# EAGLE design Display18_Cape (EAGLE 7.7.0)
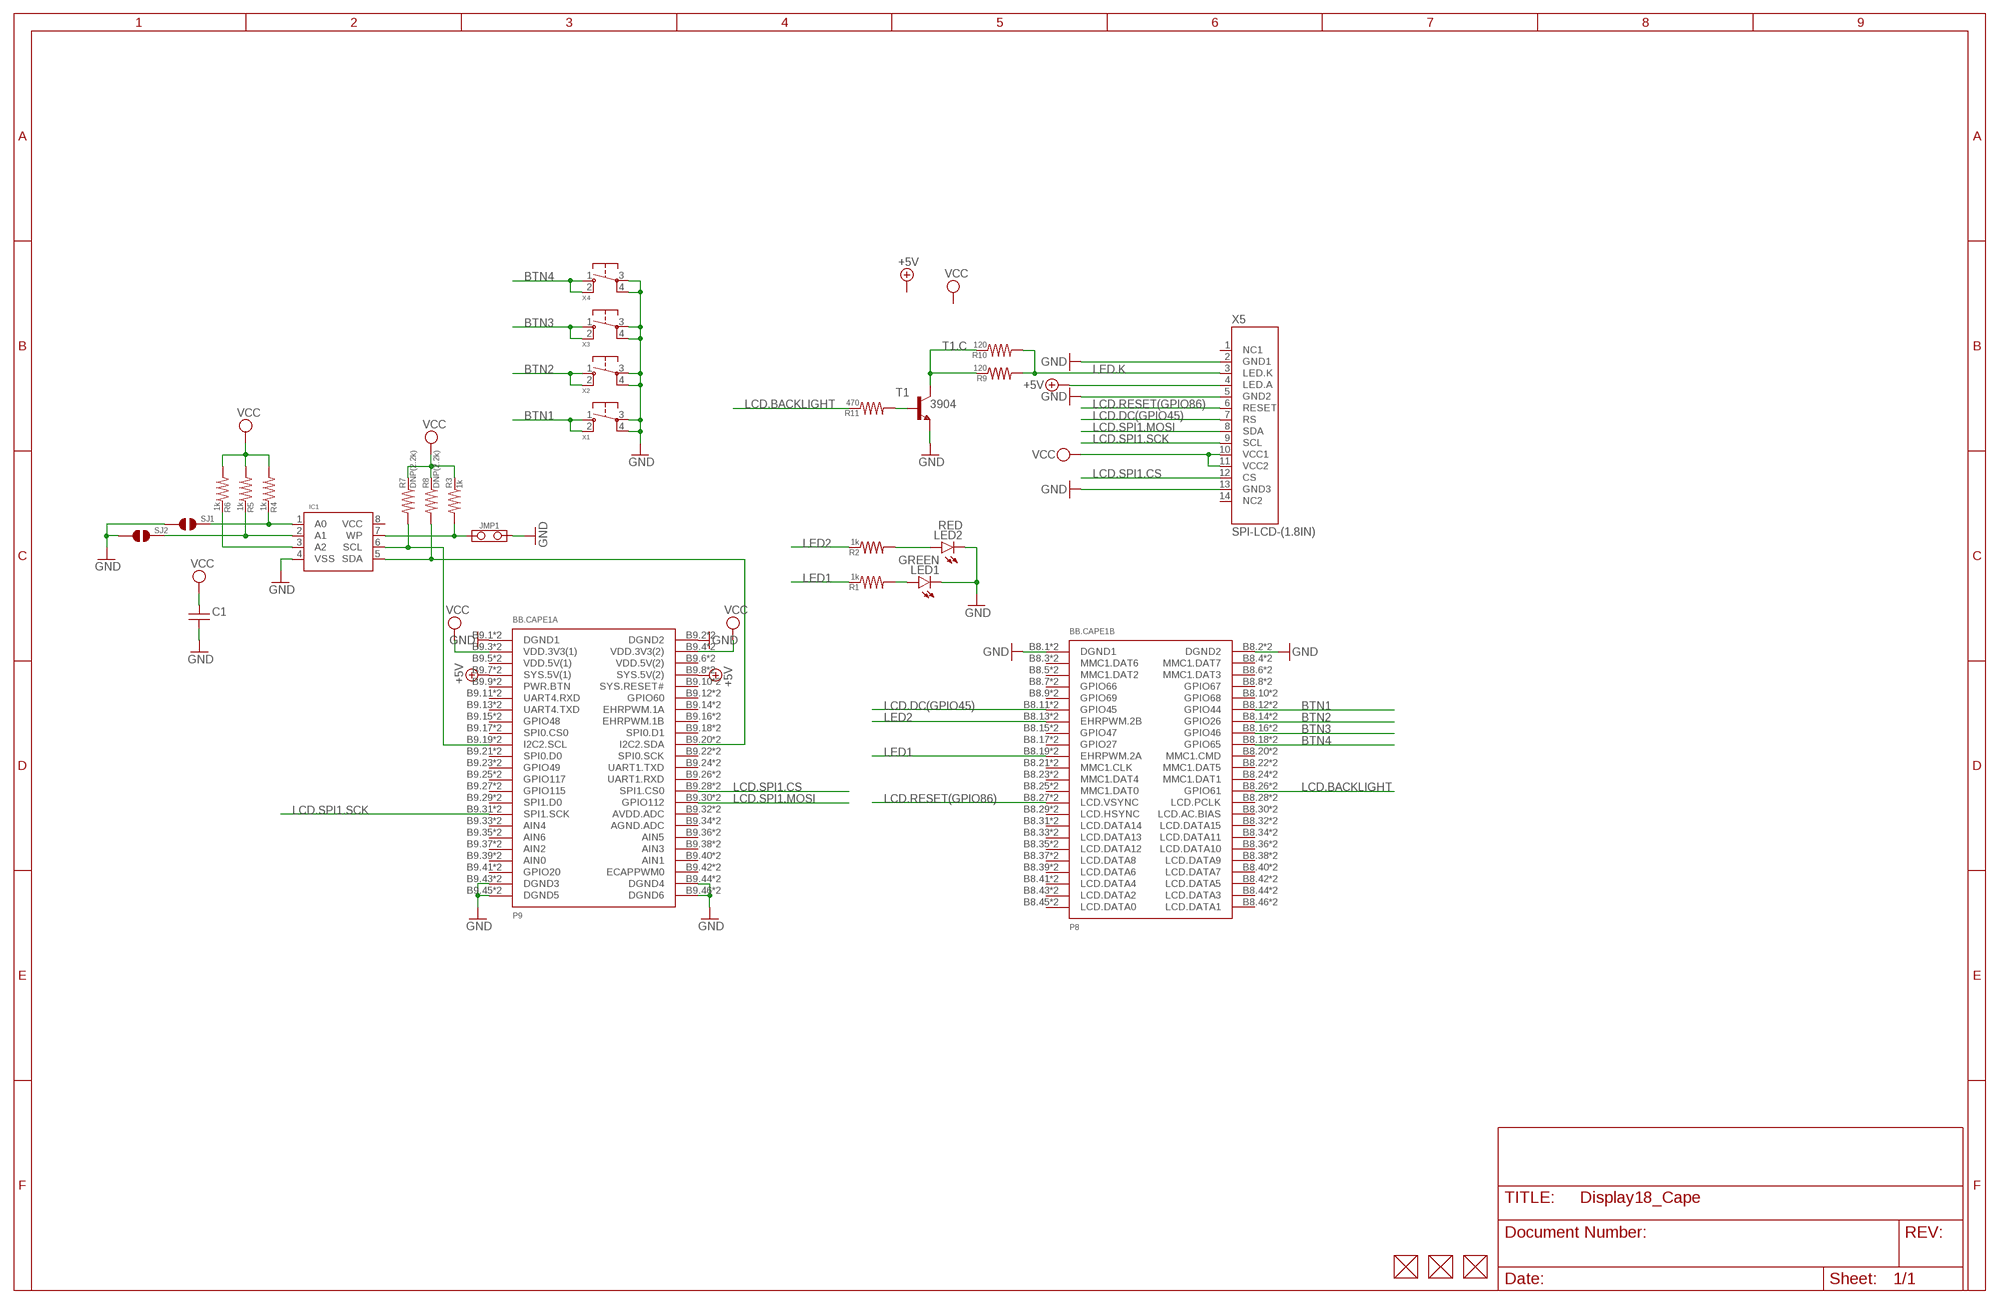
[diagram p0: schematic, sheet 1]

## Parts
BB.CAPE1  BEAGLEBONE.CAPE.BOTTOM-ONLY-PADS.W/TH  [BEAGLEBONE.CAPE.BOTTOM-ONLY-PADS.W/TH]
C1  CAPACITOR-(INCH)-0402  [0402]
FUD1  FIDUCIAL  [FIDUCIAL_40MIL]
FUD2  FIDUCIAL  [FIDUCIAL_40MIL]
FUD3  FIDUCIAL  [FIDUCIAL_40MIL]
IC1  CAT24C32  [UDFN8,2X3(ON-SEMI)]
JMP1  JUMPER-(X2)  [JUMPER-(X2)]
LED1  GREEN  LED-(INCH)-0805  [0805-LED]
LED2  RED  LED-(INCH)-0805  [0805-LED]
R1  1k  RESISTOR-(INCH)-0603  [0603]
R2  1k  RESISTOR-(INCH)-0603  [0603]
R3  1k  RESISTOR-(INCH)-0402  [0402]
R4  1k  RESISTOR-(INCH)-0402  [0402]
R5  1k  RESISTOR-(INCH)-0402  [0402]
R6  1k  RESISTOR-(INCH)-0402  [0402]
R7  DNP(2.2k)  RESISTOR-(INCH)-0402  [0402]
R8  DNP(2.2k)  RESISTOR-(INCH)-0402  [0402]
R9  120  RESISTOR-(INCH)-0603  [0603]
R10  120  RESISTOR-(INCH)-0603  [0603]
R11  470  RESISTOR-(INCH)-0603  [0603]
SJ1  SOLDER.JOINT-(INCH)-0603  [SOLDER.JOINT(0603)]
SJ2  SOLDER.JOINT-(INCH)-0603  [SOLDER.JOINT(0603)]
T1  3904  BC847-NPN-SOT23-BEC  [SOT23-BEC]
X1  6MM_TACTILE_SWITCH  [6MM_TACTILE-SWITCH]
X2  6MM_TACTILE_SWITCH  [6MM_TACTILE-SWITCH]
X3  6MM_TACTILE_SWITCH  [6MM_TACTILE-SWITCH]
X4  6MM_TACTILE_SWITCH  [6MM_TACTILE-SWITCH]
X5  SPI-LCD-(1.8IN)  [LCD-(1.8IN)]

## Nets
+5V: BB.CAPE1.B9.7(A:SYS.5V(1)) BB.CAPE1.B9.8(A:SYS.5V(2)) BB.CAPE1.P9.7(A:SYS.5V(1)) BB.CAPE1.P9.8(A:SYS.5V(2)) X5.4(LED.A)
A0: IC1.1(A0) R4.2 SJ1.2
A1: IC1.2(A1) R5.2 SJ2.2
A2: IC1.3(A2) R6.2
BTN1: BB.CAPE1.B8.12(B:GPIO44) BB.CAPE1.P8.12(B:GPIO44) X1.1 X1.2
BTN2: BB.CAPE1.B8.14(B:GPIO26) BB.CAPE1.P8.14(B:GPIO26) X2.1 X2.2
BTN3: BB.CAPE1.B8.16(B:GPIO46) BB.CAPE1.P8.16(B:GPIO46) X3.1 X3.2
BTN4: BB.CAPE1.B8.18(B:GPIO65) BB.CAPE1.P8.18(B:GPIO65) X4.1 X4.2
GND: BB.CAPE1.B8.1(B:DGND1) BB.CAPE1.B8.2(B:DGND2) BB.CAPE1.B9.1(A:DGND1) BB.CAPE1.B9.2(A:DGND2) BB.CAPE1.B9.43(A:DGND3) BB.CAPE1.B9.44(A:DGND4) BB.CAPE1.B9.45(A:DGND5) BB.CAPE1.B9.46(A:DGND6) BB.CAPE1.P8.1(B:DGND1) BB.CAPE1.P8.2(B:DGND2) BB.CAPE1.P9.1(A:DGND1) BB.CAPE1.P9.2(A:DGND2) BB.CAPE1.P9.43(A:DGND3) BB.CAPE1.P9.44(A:DGND4) BB.CAPE1.P9.45(A:DGND5) BB.CAPE1.P9.46(A:DGND6) C1.2 IC1.4(VSS) JMP1.2 LED1.K LED2.K SJ1.1 SJ2.1 T1.E X1.3 X1.4 X2.3 X2.4 X3.3 X3.4 X4.3 X4.4 X5.2(GND1) X5.5(GND2) X5.13(GND3)
LCD.BACKLIGHT: BB.CAPE1.B8.26(B:GPIO61) BB.CAPE1.P8.26(B:GPIO61) R11.2
LCD.DC(GPIO45): BB.CAPE1.B8.11(B:GPIO45) BB.CAPE1.P8.11(B:GPIO45) X5.7(RS)
LCD.RESET(GPIO86): BB.CAPE1.B8.27(B:LCD.VSYNC) BB.CAPE1.P8.27(B:LCD.VSYNC) X5.6(RESET)
LCD.SPI1.CS: BB.CAPE1.B9.28(A:SPI1.CS0) BB.CAPE1.P9.28(A:SPI1.CS0) X5.12(CS)
LCD.SPI1.MOSI: BB.CAPE1.B9.30(A:GPIO112) BB.CAPE1.P9.30(A:GPIO112) X5.8(SDA)
LCD.SPI1.SCK: BB.CAPE1.B9.31(A:SPI1.SCK) BB.CAPE1.P9.31(A:SPI1.SCK) X5.9(SCL)
LED1: BB.CAPE1.B8.19(B:EHRPWM.2A) BB.CAPE1.P8.19(B:EHRPWM.2A) R1.2
LED2: BB.CAPE1.B8.13(B:EHRPWM.2B) BB.CAPE1.P8.13(B:EHRPWM.2B) R2.2
LED.K: R9.1 R10.1 X5.3(LED.K)
N$5: R11.1 T1.B
N$282: LED1.A R1.1
N$284: LED2.A R2.1
SCL: BB.CAPE1.B9.19(A:I2C2.SCL) BB.CAPE1.P9.19(A:I2C2.SCL) IC1.6(SCL) R7.1
SDA: BB.CAPE1.B9.20(A:I2C2.SDA) BB.CAPE1.P9.20(A:I2C2.SDA) IC1.5(SDA) R8.1
T1.C: R9.2 R10.2 T1.C
VCC: BB.CAPE1.B9.3(A:VDD.3V3(1)) BB.CAPE1.B9.4(A:VDD.3V3(2)) BB.CAPE1.P9.3(A:VDD.3V3(1)) BB.CAPE1.P9.4(A:VDD.3V3(2)) C1.1 R3.2 R4.1 R5.1 R6.1 R7.2 R8.2 X5.10(VCC1) X5.11(VCC2)
WP: IC1.7(WP) JMP1.1 R3.1
Unconnected: BB.CAPE1.B8.3(B:MMC1.DAT6) BB.CAPE1.B8.4(B:MMC1.DAT7) BB.CAPE1.B8.5(B:MMC1.DAT2) BB.CAPE1.B8.6(B:MMC1.DAT3) BB.CAPE1.B8.7(B:GPIO66) BB.CAPE1.B8.8(B:GPIO67) BB.CAPE1.B8.9(B:GPIO69) BB.CAPE1.B8.10(B:GPIO68) BB.CAPE1.B8.15(B:GPIO47) BB.CAPE1.B8.17(B:GPIO27) BB.CAPE1.B8.20(B:MMC1.CMD) BB.CAPE1.B8.21(B:MMC1.CLK) BB.CAPE1.B8.22(B:MMC1.DAT5) BB.CAPE1.B8.23(B:MMC1.DAT4) BB.CAPE1.B8.24(B:MMC1.DAT1) BB.CAPE1.B8.25(B:MMC1.DAT0) BB.CAPE1.B8.28(B:LCD.PCLK) BB.CAPE1.B8.29(B:LCD.HSYNC) BB.CAPE1.B8.30(B:LCD.AC.BIAS) BB.CAPE1.B8.31(B:LCD.DATA14) BB.CAPE1.B8.32(B:LCD.DATA15) BB.CAPE1.B8.33(B:LCD.DATA13) BB.CAPE1.B8.34(B:LCD.DATA11) BB.CAPE1.B8.35(B:LCD.DATA12) BB.CAPE1.B8.36(B:LCD.DATA10) BB.CAPE1.B8.37(B:LCD.DATA8) BB.CAPE1.B8.38(B:LCD.DATA9) BB.CAPE1.B8.39(B:LCD.DATA6) BB.CAPE1.B8.40(B:LCD.DATA7) BB.CAPE1.B8.41(B:LCD.DATA4) BB.CAPE1.B8.42(B:LCD.DATA5) BB.CAPE1.B8.43(B:LCD.DATA2) BB.CAPE1.B8.44(B:LCD.DATA3) BB.CAPE1.B8.45(B:LCD.DATA0) BB.CAPE1.B8.46(B:LCD.DATA1) BB.CAPE1.B9.5(A:VDD.5V(1)) BB.CAPE1.B9.6(A:VDD.5V(2)) BB.CAPE1.B9.9(A:PWR.BTN) BB.CAPE1.B9.10(A:SYS.RESET#) BB.CAPE1.B9.11(A:UART4.RXD) BB.CAPE1.B9.12(A:GPIO60) BB.CAPE1.B9.13(A:UART4.TXD) BB.CAPE1.B9.14(A:EHRPWM.1A) BB.CAPE1.B9.15(A:GPIO48) BB.CAPE1.B9.16(A:EHRPWM.1B) BB.CAPE1.B9.17(A:SPI0.CS0) BB.CAPE1.B9.18(A:SPI0.D1) BB.CAPE1.B9.21(A:SPI0.D0) BB.CAPE1.B9.22(A:SPI0.SCK) BB.CAPE1.B9.23(A:GPIO49) BB.CAPE1.B9.24(A:UART1.TXD) BB.CAPE1.B9.25(A:GPIO117) BB.CAPE1.B9.26(A:UART1.RXD) BB.CAPE1.B9.27(A:GPIO115) BB.CAPE1.B9.29(A:SPI1.D0) BB.CAPE1.B9.32(A:AVDD.ADC) BB.CAPE1.B9.33(A:AIN4) BB.CAPE1.B9.34(A:AGND.ADC) BB.CAPE1.B9.35(A:AIN6) BB.CAPE1.B9.36(A:AIN5) BB.CAPE1.B9.37(A:AIN2) BB.CAPE1.B9.38(A:AIN3) BB.CAPE1.B9.39(A:AIN0) BB.CAPE1.B9.40(A:AIN1) BB.CAPE1.B9.41(A:GPIO20) BB.CAPE1.B9.42(A:ECAPPWM0) BB.CAPE1.P8.3(B:MMC1.DAT6) BB.CAPE1.P8.4(B:MMC1.DAT7) BB.CAPE1.P8.5(B:MMC1.DAT2) BB.CAPE1.P8.6(B:MMC1.DAT3) BB.CAPE1.P8.7(B:GPIO66) BB.CAPE1.P8.8(B:GPIO67) BB.CAPE1.P8.9(B:GPIO69) BB.CAPE1.P8.10(B:GPIO68) BB.CAPE1.P8.15(B:GPIO47) BB.CAPE1.P8.17(B:GPIO27) BB.CAPE1.P8.20(B:MMC1.CMD) BB.CAPE1.P8.21(B:MMC1.CLK) BB.CAPE1.P8.22(B:MMC1.DAT5) BB.CAPE1.P8.23(B:MMC1.DAT4) BB.CAPE1.P8.24(B:MMC1.DAT1) BB.CAPE1.P8.25(B:MMC1.DAT0) BB.CAPE1.P8.28(B:LCD.PCLK) BB.CAPE1.P8.29(B:LCD.HSYNC) BB.CAPE1.P8.30(B:LCD.AC.BIAS) BB.CAPE1.P8.31(B:LCD.DATA14) BB.CAPE1.P8.32(B:LCD.DATA15) BB.CAPE1.P8.33(B:LCD.DATA13) BB.CAPE1.P8.34(B:LCD.DATA11) BB.CAPE1.P8.35(B:LCD.DATA12) BB.CAPE1.P8.36(B:LCD.DATA10) BB.CAPE1.P8.37(B:LCD.DATA8) BB.CAPE1.P8.38(B:LCD.DATA9) BB.CAPE1.P8.39(B:LCD.DATA6) BB.CAPE1.P8.40(B:LCD.DATA7) BB.CAPE1.P8.41(B:LCD.DATA4) BB.CAPE1.P8.42(B:LCD.DATA5) BB.CAPE1.P8.43(B:LCD.DATA2) BB.CAPE1.P8.44(B:LCD.DATA3) BB.CAPE1.P8.45(B:LCD.DATA0) BB.CAPE1.P8.46(B:LCD.DATA1) BB.CAPE1.P9.5(A:VDD.5V(1)) BB.CAPE1.P9.6(A:VDD.5V(2)) BB.CAPE1.P9.9(A:PWR.BTN) BB.CAPE1.P9.10(A:SYS.RESET#) BB.CAPE1.P9.11(A:UART4.RXD) BB.CAPE1.P9.12(A:GPIO60) BB.CAPE1.P9.13(A:UART4.TXD) BB.CAPE1.P9.14(A:EHRPWM.1A) BB.CAPE1.P9.15(A:GPIO48) BB.CAPE1.P9.16(A:EHRPWM.1B) BB.CAPE1.P9.17(A:SPI0.CS0) BB.CAPE1.P9.18(A:SPI0.D1) BB.CAPE1.P9.21(A:SPI0.D0) BB.CAPE1.P9.22(A:SPI0.SCK) BB.CAPE1.P9.23(A:GPIO49) BB.CAPE1.P9.24(A:UART1.TXD) BB.CAPE1.P9.25(A:GPIO117) BB.CAPE1.P9.26(A:UART1.RXD) BB.CAPE1.P9.27(A:GPIO115) BB.CAPE1.P9.29(A:SPI1.D0) BB.CAPE1.P9.32(A:AVDD.ADC) BB.CAPE1.P9.33(A:AIN4) BB.CAPE1.P9.34(A:AGND.ADC) BB.CAPE1.P9.35(A:AIN6) BB.CAPE1.P9.36(A:AIN5) BB.CAPE1.P9.37(A:AIN2) BB.CAPE1.P9.38(A:AIN3) BB.CAPE1.P9.39(A:AIN0) BB.CAPE1.P9.40(A:AIN1) BB.CAPE1.P9.41(A:GPIO20) BB.CAPE1.P9.42(A:ECAPPWM0) FUD1.P$1 FUD2.P$1 FUD3.P$1 IC1.8(VCC) X5.1(NC1) X5.14(NC2)

## Library data of the parts
BB.CAPE1 = GHI-Solutions:BEAGLEBONE.CAPE.
C1 = GHI-BasicComponents:CAPACITOR-(INCH)-: Basic SMD ceramic capacitors
FUD1-FUD3 = GHI:FIDUCIAL
IC1 = GHI-IC:CAT24C32: 32-Kb I2C CMOS Serial EEPROM
JMP1 = GHI-Headers:JUMPER-(X2)
LED1 LED2 = GHI-BasicComponents:LED-(INCH)-: Basic SMD LEDs
R1-R11 = GHI-BasicComponents:RESISTOR-(INCH)-: Basic SMD Resistors
SJ1 SJ2 = GHI-Miscellaneous:SOLDER.JOINT-(INCH)-: Solder Joint (Bridge) Pads - For easy solder joining.
T1 = transistor:*-NPN-: NPN Transistror BF959 corrected 2008.03.06
X1-X4 = GHI2:6MM_TACTILE_SWITCH
X5 = GHI-Connectors:SPI-LCD-(1.8IN)

## Board
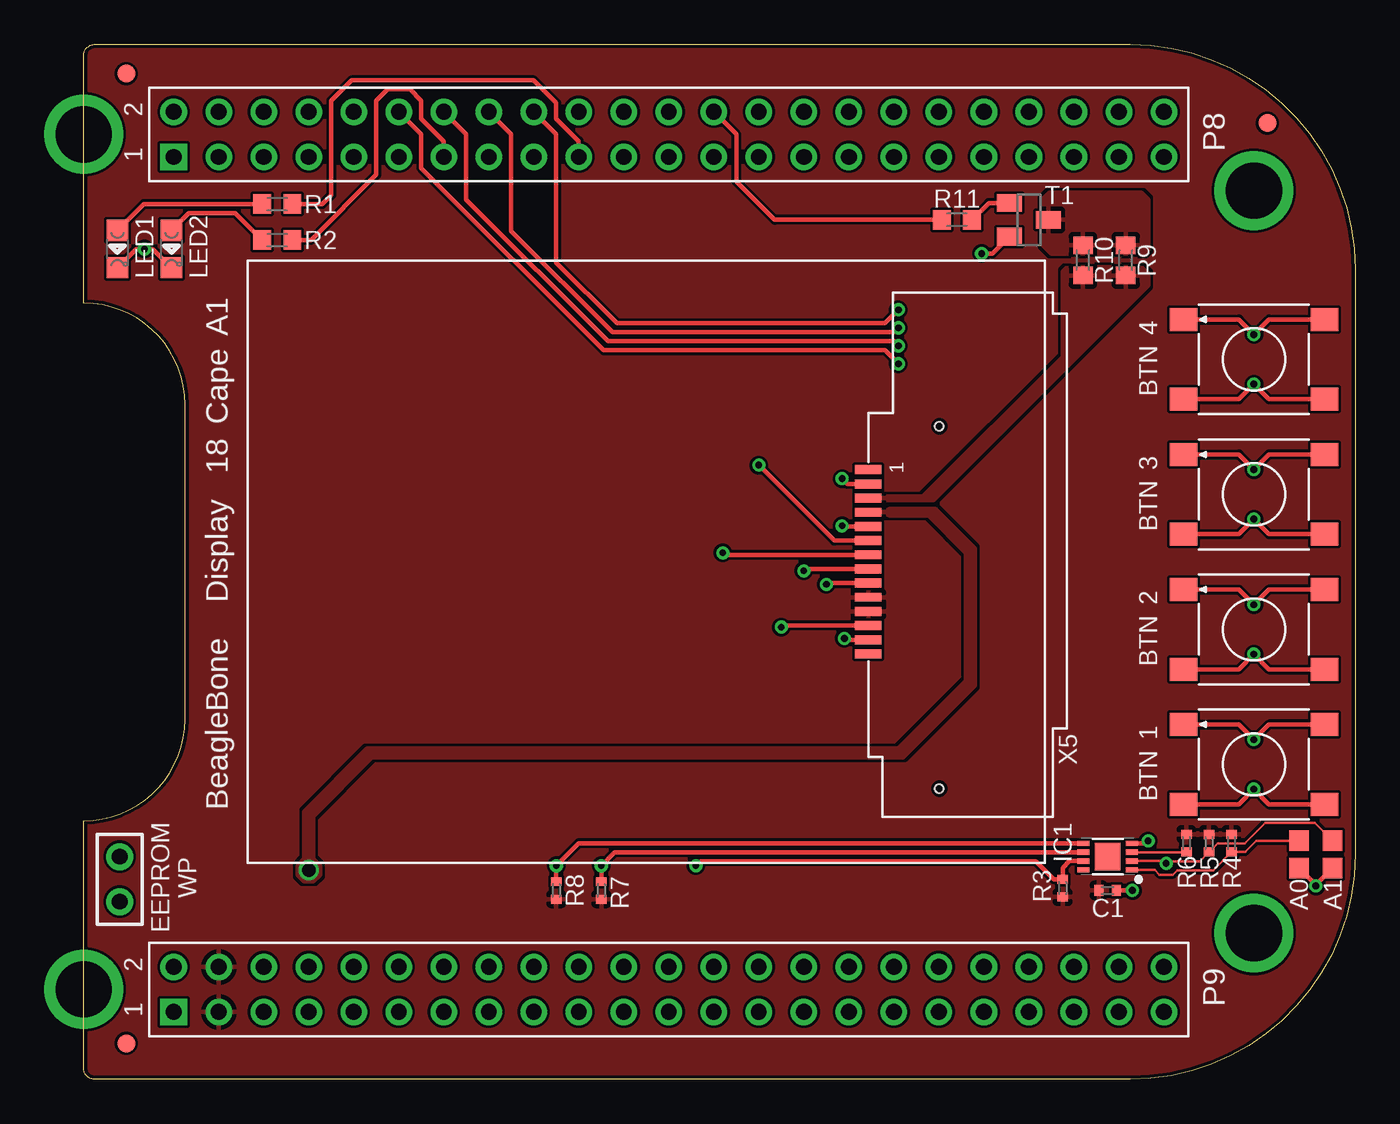
[diagram p1: board, top side]
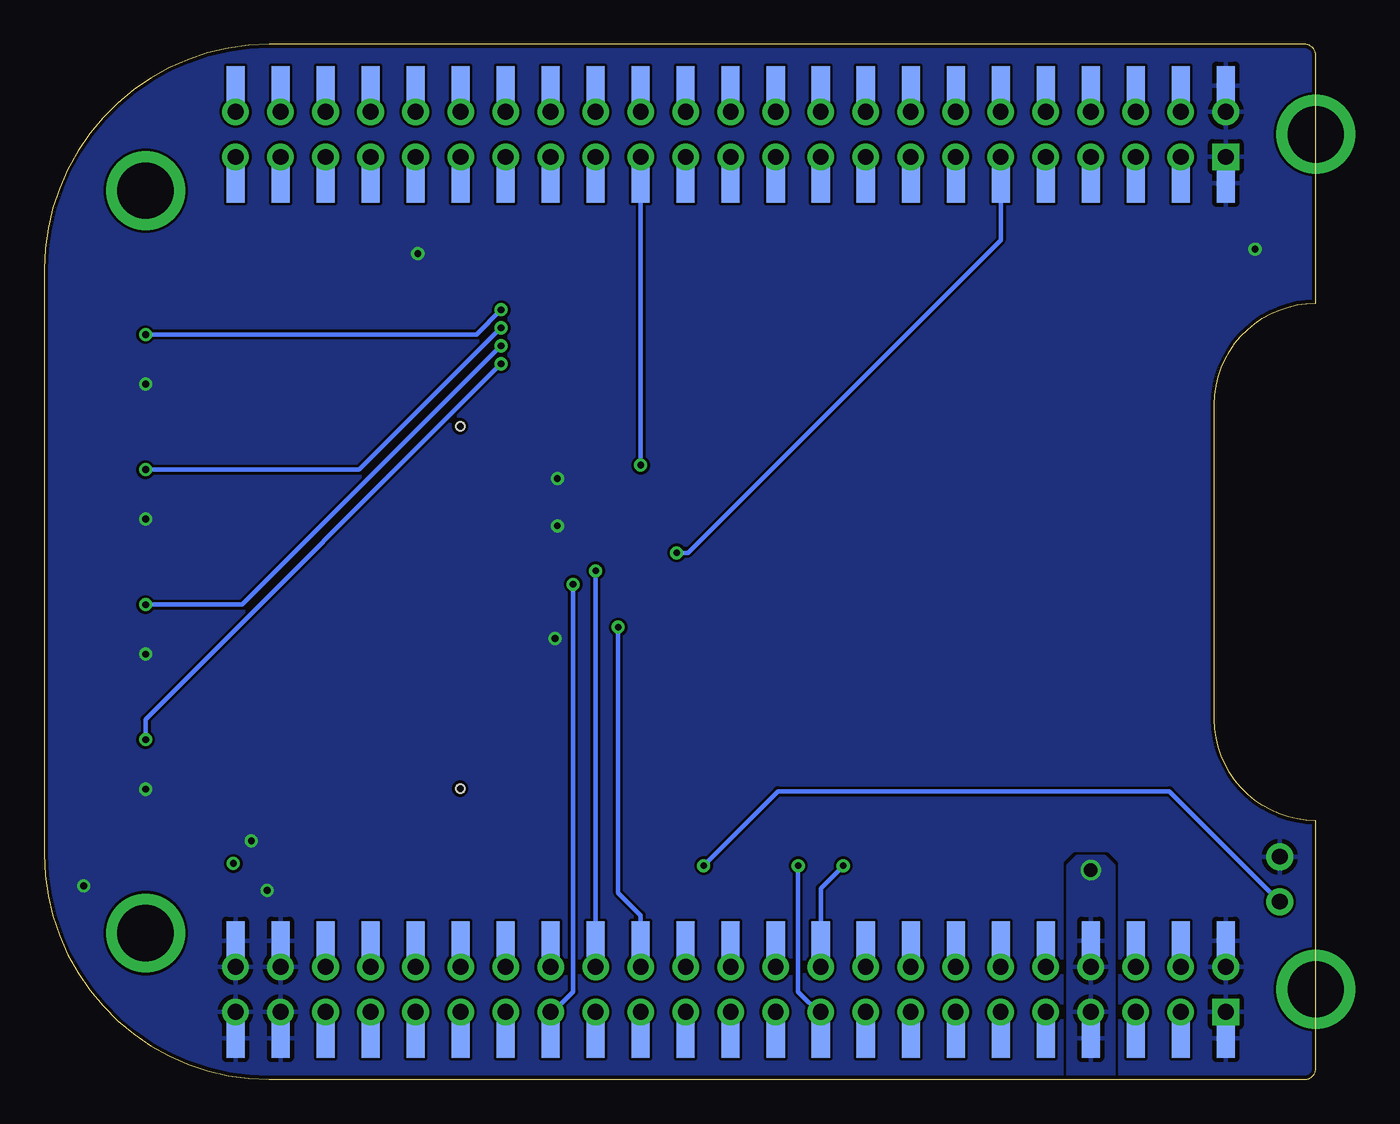
[diagram p2: board, bottom side, seen from below]

Size 71.75 x 58.42 mm. Coordinates in mm from the lower left corner, seen from the top.
Copper layers (1+16): Top 0.035mm / dielectric 1.5mm / Bottom 0.035mm
Design rules "SparkFun-2-layer *": minimum track width 6mil, minimum drill 15mil, track to track 6mil, track to pad 6mil, pad to pad 6mil, via to via 6mil, smd to smd 6mil, copper to edge 8mil, drill to drill 8mil, minimum pad ring 12mil, minimum via ring 7mil, stop-mask expansion 4mil, vias tented up to drill 32mil, thermal gap 10mil
tRestrict: 4 lines

### Footprints (pad centres in the part's own frame; a part is rotated, then mirrored left to right if it is on the bottom)
BEAGLEBONE.CAPE.BOTTOM-ONLY-PADS.W/TH = smd 1.02 x 2.2 bottom: B8.1 5.08,50.59; B8.2 5.08,56.09; B8.3 7.62,50.59; B8.4 7.62,56.09; B8.5 10.16,50.59; B8.6 10.16,56.09; B8.7 12.7,50.59; B8.8 12.7,56.09; B8.9 15.24,50.59; B8.10 15.24,56.09; B8.11 17.78,50.59; B8.12 17.78,56.09; B8.13 20.32,50.59; B8.14 20.32,56.09; B8.15 22.86,50.59; B8.16 22.86,56.09; B8.17 25.4,50.59; B8.18 25.4,56.09; B8.19 27.94,50.59; B8.20 27.94,56.09; B8.21 30.48,50.59; B8.22 30.48,56.09; B8.23 33.02,50.59; B8.24 33.02,56.09; B8.25 35.56,50.59; B8.26 35.56,56.09; B8.27 38.1,50.59; B8.28 38.1,56.09; B8.29 40.64,50.59; B8.30 40.64,56.09; B8.31 43.18,50.59; B8.32 43.18,56.09; B8.33 45.72,50.59; B8.34 45.72,56.09; B8.35 48.26,50.59; B8.36 48.26,56.09; B8.37 50.8,50.59; B8.38 50.8,56.09; B8.39 53.34,50.59; B8.40 53.34,56.09; B8.41 55.88,50.59; B8.42 55.88,56.09; B8.43 58.42,50.59; B8.44 58.42,56.09; B8.45 60.96,50.59; B8.46 60.96,56.09; B9.1 5.08,2.33; B9.2 5.08,7.83; B9.3 7.62,2.33; B9.4 7.62,7.83; B9.5 10.16,2.33; B9.6 10.16,7.83; B9.7 12.7,2.33; B9.8 12.7,7.83; B9.9 15.24,2.33; B9.10 15.24,7.83; B9.11 17.78,2.33; B9.12 17.78,7.83; B9.13 20.32,2.33; B9.14 20.32,7.83; B9.15 22.86,2.33; B9.16 22.86,7.83; B9.17 25.4,2.33; B9.18 25.4,7.83; B9.19 27.94,2.33; B9.20 27.94,7.83; B9.21 30.48,2.33; B9.22 30.48,7.83; B9.23 33.02,2.33; B9.24 33.02,7.83; B9.25 35.56,2.33; B9.26 35.56,7.83; B9.27 38.1,2.33; B9.28 38.1,7.83; B9.29 40.64,2.33; B9.30 40.64,7.83; B9.31 43.18,2.33; B9.32 43.18,7.83; B9.33 45.72,2.33; B9.34 45.72,7.83; B9.35 48.26,2.33; B9.36 48.26,7.83; B9.37 50.8,2.33; B9.38 50.8,7.83; B9.39 53.34,2.33; B9.40 53.34,7.83; B9.41 55.88,2.33; B9.42 55.88,7.83; B9.43 58.42,2.33; B9.44 58.42,7.83; B9.45 60.96,2.33; B9.46 60.96,7.83 | drill 3.175 pad 4.445: MH.1 0,5.08; MH.2 66.04,8.255; MH.3 66.04,50.165; MH.4 0,53.34 | drill 0.889 square: P8.1 5.08,52.07; P9.1 5.08,3.81 | drill 0.889: P8.2 5.08,54.61; P8.3 7.62,52.07; P8.4 7.62,54.61; P8.5 10.16,52.07; P8.6 10.16,54.61; P8.7 12.7,52.07; P8.8 12.7,54.61; P8.9 15.24,52.07; P8.10 15.24,54.61; P8.11 17.78,52.07; P8.12 17.78,54.61; P8.13 20.32,52.07; P8.14 20.32,54.61; P8.15 22.86,52.07; P8.16 22.86,54.61; P8.17 25.4,52.07; P8.18 25.4,54.61; P8.19 27.94,52.07; P8.20 27.94,54.61; P8.21 30.48,52.07; P8.22 30.48,54.61; P8.23 33.02,52.07; P8.24 33.02,54.61; P8.25 35.56,52.07; P8.26 35.56,54.61; P8.27 38.1,52.07; P8.28 38.1,54.61; P8.29 40.64,52.07; P8.30 40.64,54.61; P8.31 43.18,52.07; P8.32 43.18,54.61; P8.33 45.72,52.07; P8.34 45.72,54.61; P8.35 48.26,52.07; P8.36 48.26,54.61; P8.37 50.8,52.07; P8.38 50.8,54.61; P8.39 53.34,52.07; P8.40 53.34,54.61; P8.41 55.88,52.07; P8.42 55.88,54.61; P8.43 58.42,52.07; P8.44 58.42,54.61; P8.45 60.96,52.07; P8.46 60.96,54.61; P9.2 5.08,6.35; P9.3 7.62,3.81; P9.4 7.62,6.35; P9.5 10.16,3.81; P9.6 10.16,6.35; P9.7 12.7,3.81; P9.8 12.7,6.35; P9.9 15.24,3.81; P9.10 15.24,6.35; P9.11 17.78,3.81; P9.12 17.78,6.35; P9.13 20.32,3.81; P9.14 20.32,6.35; P9.15 22.86,3.81; P9.16 22.86,6.35; P9.17 25.4,3.81; P9.18 25.4,6.35; P9.19 27.94,3.81; P9.20 27.94,6.35; P9.21 30.48,3.81; P9.22 30.48,6.35; P9.23 33.02,3.81; P9.24 33.02,6.35; P9.25 35.56,3.81; P9.26 35.56,6.35; P9.27 38.1,3.81; P9.28 38.1,6.35; P9.29 40.64,3.81; P9.30 40.64,6.35; P9.31 43.18,3.81; P9.32 43.18,6.35; P9.33 45.72,3.81; P9.34 45.72,6.35; P9.35 48.26,3.81; P9.36 48.26,6.35; P9.37 50.8,3.81; P9.38 50.8,6.35; P9.39 53.34,3.81; P9.40 53.34,6.35; P9.41 55.88,3.81; P9.42 55.88,6.35; P9.43 58.42,3.81; P9.44 58.42,6.35; P9.45 60.96,3.81; P9.46 60.96,6.35
0402 = smd 0.5 x 0.6: 1 -0.5,0; 2 0.5,0
FIDUCIAL_40MIL = smd 1.016 x 1.016: P$1 0,0
UDFN8,2X3(ON-SEMI) = smd 0.3 x 0.68: 1 0.75,1.36; 2 0.25,1.36; 3 -0.25,1.36; 4 -0.75,1.36; 5 -0.75,-1.36; 6 -0.25,-1.36; 7 0.25,-1.36; 8 0.75,-1.36 | smd 1.56 x 1.45: P$1 0,0
JUMPER-(X2) = drill 0.889 pad 1.524: 1 -1.27,0; 2 1.27,0
0805-LED = smd 1.2 x 1.2: A 0,1.05; K 0,-1.05
0603 = smd 1 x 1.1: 1 -0.85,0; 2 0.85,0
SOLDER.JOINT(0603) = smd 1.15 x 1.1: 1 -0.775,0; 2 0.775,0
SOT23-BEC = smd 1 x 1.4: B -0.95,-1.1; C 0,1.1; E 0.95,-1.1
6MM_TACTILE-SWITCH = smd 1.55 x 1.3: 1 -3.975,2.25; 2 3.975,2.25; 3 -3.975,-2.25; 4 3.975,-2.25
LCD-(1.8IN) = smd 0.5 x 1.5: 1 5.2,-12.532; 2 4.4,-12.532; 3 3.6,-12.532; 4 2.8,-12.532; 5 2,-12.532; 6 1.2,-12.532; 7 0.4,-12.532; 8 -0.4,-12.532; 9 -1.2,-12.532; 10 -2,-12.532; 11 -2.8,-12.532; 12 -3.6,-12.532; 13 -4.4,-12.532; 14 -5.2,-12.532 | hole 0.5: -12.8,-16.532; 7.65,-16.532

### Placement (x,y rotation side)
BB.CAPE1  0,0 0 top
C1  57.78,10.67 0 top
FUD1  2.41,2.03 0 top
FUD2  66.8,53.98 0 top
FUD3  2.41,56.77 0 top
IC1  57.78,12.57 270 top
JMP1  2.03,11.3 90 top
LED1  1.91,46.86 0 top
LED2  4.95,46.86 0 top
R1  10.92,49.4 0 top
R2  10.92,47.37 0 top
R3  55.24,10.79 270 top
R4  64.77,13.34 270 top
R5  63.5,13.34 270 top
R6  62.23,13.34 270 top
R7  29.21,10.67 270 top
R8  26.67,10.67 270 top
R9  58.8,46.23 90 top
R10  56.39,46.23 90 top
R11  49.28,48.51 180 top
SJ1  68.58,12.7 90 top
SJ2  70.48,12.7 90 top
T1  53.34,48.51 270 top
X1  66.04,17.78 0 top
X2  66.04,25.4 0 top
X3  66.04,33.02 0 top
X4  66.04,40.64 0 top
X5  31.75,29.21 90 top

### Tracks (layer width: path | path; a pad name or v marks a point on that pad's centre or on a via)
+5V  (via drill 0.76 pad 0.18)
  Bottom 0.254: BB.CAPE1.B9.8 BB.CAPE1.P9.8 | BB.CAPE1.B9.7 BB.CAPE1.P9.7
  other vias: 12.7,11.81
  pour Bottom: 11.43,12.06 11.43,0 11.81,-0.38 13.59,-0.38 13.97,0 13.97,12.06 13.46,12.57 11.94,12.57
  pour Top: 12.45,11.18 12.95,11.18 13.34,11.56 13.34,12.06 12.95,12.45 12.95,14.86 16.26,18.16 46.23,18.16 50.29,22.23 50.29,29.97 48.07,32.19 45.47,32.19 45.4,32.13 44.2,32.13 44.2,31.88 45.4,31.88 45.47,31.81 47.69,31.81 49.78,29.72 49.78,22.48 45.97,18.67 16,18.67 12.45,15.11 12.45,12.45 12.06,12.06 12.06,11.56
A0
  Top 0.152: IC1.1 60.44,11.82 60.71,11.56 61.47,11.56 61.72,11.81 63.75,11.81 R4.2 65.54,12.84 66.18,13.47 SJ1.2
A1  (via drill 0.38 pad 0.18)
  Top 0.152: IC1.2 60.96,12.32 v61.09,12.19 61.21,12.32 62.98,12.32 R5.2 64,13.34 65.53,13.34 66.67,14.48 69.48,14.48 SJ2.2
A2
  Top 0.152: IC1.3 62.22,12.82 R6.2
BTN1  (via drill 0.38 pad 0.18)
  Top 0.254: BB.CAPE1.P8.12 19.05,53.34 19.05,51.44 29.34,41.15 45.21,41.15 v45.97,40.39 | X1.2 66.89,20.03 v66.04,19.18 65.19,20.03 X1.1
  Bottom 0.254: BB.CAPE1.B8.12 BB.CAPE1.P8.12 | v45.97,40.39 66.04,20.32 v66.04,19.18
BTN2  (via drill 0.38 pad 0.18)
  Top 0.254: BB.CAPE1.P8.14 21.59,53.34 21.59,49.66 29.59,41.66 45.72,41.66 v45.97,41.4 | X2.2 66.89,27.65 v66.04,26.8 65.19,27.65 X2.1
  Bottom 0.254: BB.CAPE1.B8.14 BB.CAPE1.P8.14 | v66.04,26.8 60.58,26.8 v45.97,41.4
BTN3  (via drill 0.38 pad 0.18)
  Top 0.254: BB.CAPE1.P8.16 24.13,53.34 24.13,47.88 29.84,42.16 45.72,42.16 v45.97,42.42 | X3.2 66.89,35.27 v66.04,34.42 65.19,35.27 X3.1
  Bottom 0.254: BB.CAPE1.B8.16 BB.CAPE1.P8.16 | v66.04,34.42 53.98,34.42 v45.97,42.42
BTN4  (via drill 0.38 pad 0.18)
  Top 0.254: BB.CAPE1.P8.18 26.67,53.34 26.67,46.1 30.1,42.67 45.21,42.67 v45.97,43.43 | X4.2 66.89,42.89 v66.04,42.04 65.19,42.89 X4.1
  Bottom 0.254: BB.CAPE1.B8.18 BB.CAPE1.P8.18 | v45.97,43.43 47.37,42.04 v66.04,42.04
GND  (via drill 0.38 pad 0.18)
  Top 0.254: X1.3 65.19,15.53 v66.04,16.38 66.89,15.53 X1.4 | X2.3 65.19,23.15 v66.04,24 66.89,23.15 X2.4 | X3.3 65.19,30.77 v66.04,31.62 66.89,30.77 X3.4 | X4.3 65.19,38.39 v66.04,39.24 66.89,38.39 X4.4 | C1.2 v59.18,10.67 | IC1.4 59.93,13.32 v60.07,13.46 | SJ1.1 69.53,10.97 | v69.53,10.92 69.53,10.97 | 69.53,10.97 SJ2.1 | X5.5 42.83,31.21 v42.8,31.24 | X5.2 43.1,33.61 v42.8,33.91 | X5.13 43.01,24.81 v42.93,24.89 | T1.E 51.28,46.61 v50.67,46.61 | LED1.K 2.96,46.86 v3.43,46.86 3.9,46.86 LED2.K
  Bottom 0.254: BB.CAPE1.P9.44 BB.CAPE1.B9.44 | BB.CAPE1.P9.46 BB.CAPE1.B9.46 | BB.CAPE1.P9.45 BB.CAPE1.B9.45 | BB.CAPE1.P9.43 BB.CAPE1.B9.43
  pour Bottom (rank 2): 72.39,59.05 -0.64,59.05 -0.64,-0.64 72.39,-0.64 72.39,59.05
LCD.BACKLIGHT
  Top 0.254: R11.2 38.99,48.51 36.83,50.67 36.83,53.34 BB.CAPE1.P8.26
  Bottom 0.254: BB.CAPE1.B8.26 BB.CAPE1.P8.26
LCD.DC(GPIO45)  (via drill 0.38 pad 0.18)
  Top 0.254: X5.7 36.18,29.61 v36.07,29.72
  Bottom 0.254: BB.CAPE1.P8.11 BB.CAPE1.B8.11 17.78,47.37 35.43,29.72 v36.07,29.72
LCD.RESET(GPIO86)  (via drill 0.38 pad 0.18)
  Top 0.254: X5.6 42.36,30.41 v38.1,34.67
  Bottom 0.254: BB.CAPE1.P8.27 BB.CAPE1.B8.27 v38.1,34.67
LCD.SPI1.CS  (via drill 0.38 pad 0.18)
  Top 0.254: X5.12 39.45,25.61 v39.37,25.53
  Bottom 0.254: BB.CAPE1.P9.28 BB.CAPE1.B9.28 38.1,9.27 39.37,10.54 v39.37,25.53
LCD.SPI1.MOSI  (via drill 0.38 pad 0.18)
  Top 0.254: X5.8 40.75,28.81 v40.64,28.7
  Bottom 0.254: BB.CAPE1.P9.30 BB.CAPE1.B9.30 v40.64,28.7
LCD.SPI1.SCK  (via drill 0.38 pad 0.18)
  Top 0.254: X5.9 41.98,28.01 v41.91,27.94
  Bottom 0.254: BB.CAPE1.P9.31 BB.CAPE1.B9.31 43.18,3.68 41.91,4.95 v41.91,27.94
LED1
  Top 0.254: BB.CAPE1.P8.19 27.94,52.96 26.67,54.23 26.67,55.12 25.4,56.39 15.11,56.39 13.97,55.24 13.97,49.91 13.46,49.4 R1.2
  Bottom 0.254: BB.CAPE1.B8.19 BB.CAPE1.P8.19
LED2
  Top 0.254: BB.CAPE1.P8.13 20.32,52.96 19.05,54.23 19.05,55.24 18.41,55.88 17.14,55.88 16.51,55.24 16.51,51.05 12.83,47.37 R2.2
  Bottom 0.254: BB.CAPE1.B8.13 BB.CAPE1.P8.13
LED.K
  pour Top: 44.2,32.7 47.94,32.7 60.07,44.83 60.07,45.47 59.69,45.85 55.5,45.85 55.24,45.59 55.24,40.77 47.37,32.89 44.2,32.89
N$5
  Top 0.254: T1.B 51.08,49.46 R11.1
N$282
  Top 0.254: R1.1 3.4,49.4 LED1.A
N$284
  Top 0.254: 4.99,47.88 LED2.A 5.93,48.9 8.55,48.9 R2.1
SCL  (via drill 0.38 pad 0.18)
  Top 0.254: IC1.6 29.97,12.82 v29.21,12.06 R7.1
  Bottom 0.254: BB.CAPE1.P9.19 BB.CAPE1.B9.19 27.94,3.68 29.21,4.95 v29.21,12.06
SDA  (via drill 0.38 pad 0.18)
  Top 0.254: IC1.5 27.93,13.32 v26.67,12.06 R8.1
  Bottom 0.254: BB.CAPE1.P9.20 BB.CAPE1.B9.20 27.94,10.79 v26.67,12.06
T1.C
  pour Top: 54.1,47.12 54.1,49.66 54.48,50.04 59.69,50.04 60.07,49.66 60.07,46.86 59.82,46.61 54.61,46.61
VCC
  Bottom 0.254: BB.CAPE1.B9.3 BB.CAPE1.P9.3 | BB.CAPE1.B9.4 BB.CAPE1.P9.4
  pour Top (rank 2): -1.27,59.69 -1.27,-1.27 73.03,-1.27 73.03,59.69 73.03,59.69
WP  (via drill 0.38 pad 0.18)
  Top 0.254: IC1.7 55.63,12.32 55.24,11.94 R3.1 54.74,11.29 53.72,12.32 34.8,12.32 v34.54,12.06
  Bottom 0.254: v34.54,12.06 30.35,16.26 8.26,16.26 JMP1.1

### Text on the board
tPlace: A1 | 4 | BTN | Cape | 18 | 3 | BTN | Display | 2 | BTN | BeagleBone | 1 | BTN | EEPROM / WP | A0 | A1